# Altium schematic sheet Port.SchDoc
size A4
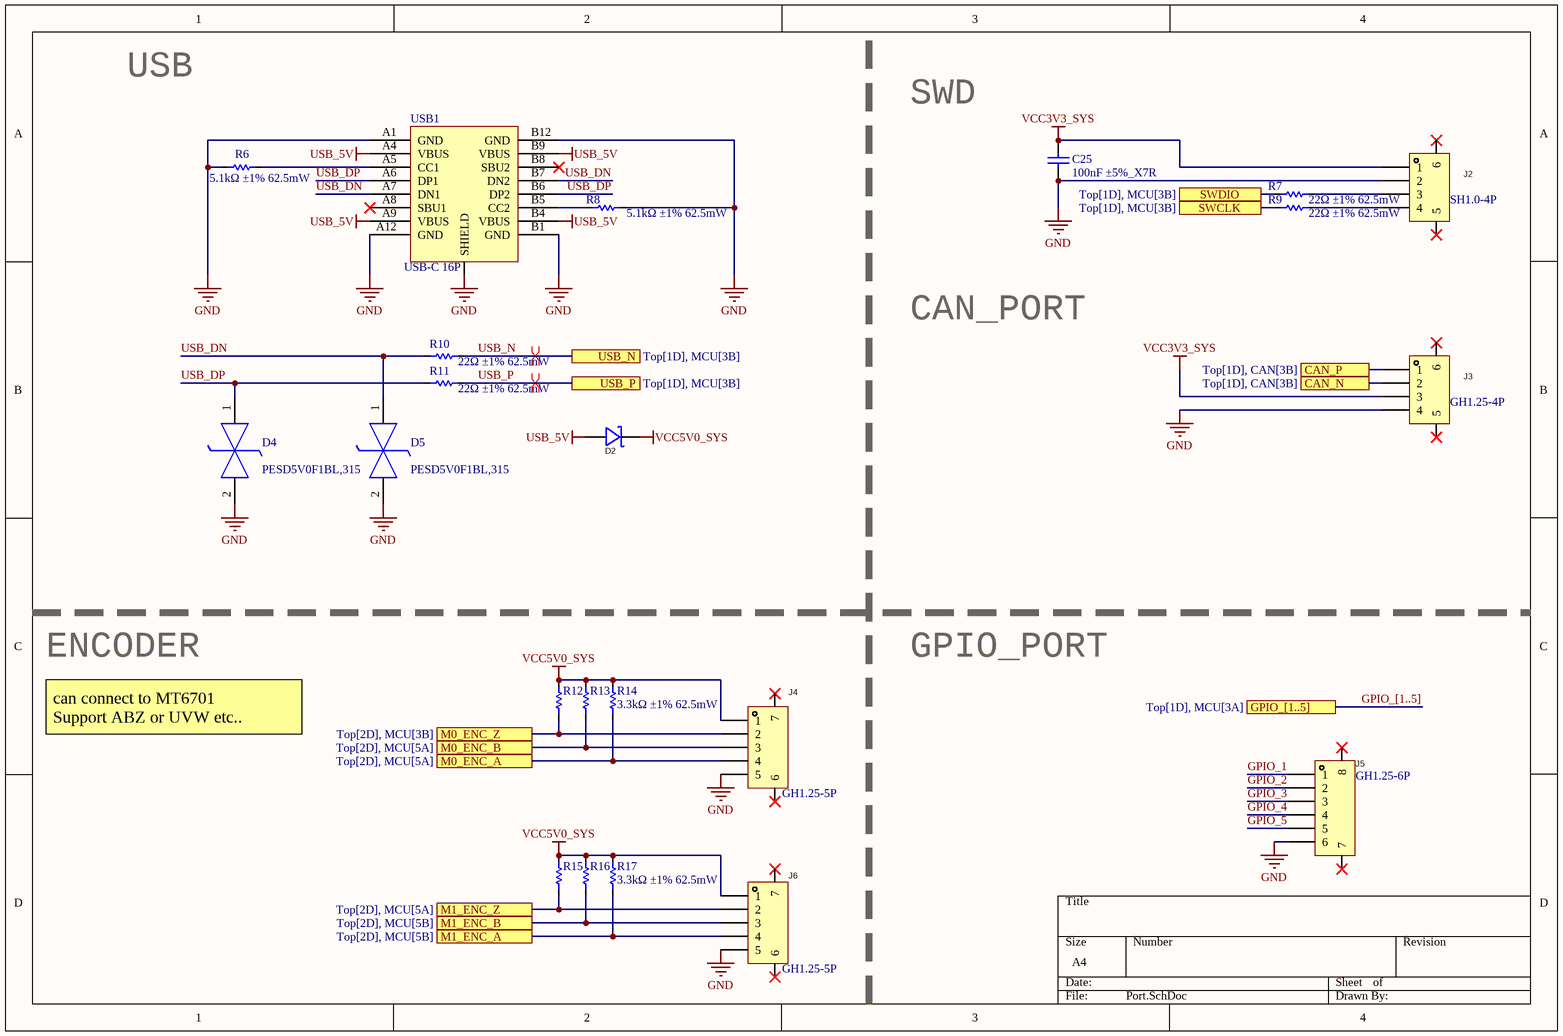
[diagram p0: Port.SchDoc]

## Parts
C25  100nF ±5%_X7R  [C0402]
D2  B340A-13-F  [SMA_L4.4-W2.6-LS5.0-RD]  (value not drawn)
D4  PESD5V0F1BL,315  [PESD5V0S1BL315]
D5  PESD5V0F1BL,315  [PESD5V0S1BL315]
J2  SH1.0-4P  [CONN-SMD_4P-P1.00_BX-SH1.0-4PWT]
J3  GH1.25-4P  [GH1.25-4P]
J4  GH1.25-5P  [GH1.25-5P]
J5  GH1.25-6P  [GH1.25-6P]
J6  GH1.25-5P  [GH1.25-5P]
R6  5.1kΩ ±1% 62.5mW  [R0402]
R7  22Ω ±1% 62.5mW  [R0402]
R8  5.1kΩ ±1% 62.5mW  [R0402]
R9  22Ω ±1% 62.5mW  [R0402]
R10  22Ω ±1% 62.5mW  [R0402]
R11  22Ω ±1% 62.5mW  [R0402]
R12  3.3kΩ ±1% 62.5mW  [R0402]  (value not drawn)
R13  3.3kΩ ±1% 62.5mW  [R0402]  (value not drawn)
R14  3.3kΩ ±1% 62.5mW  [R0402]
R15  3.3kΩ ±1% 62.5mW  [R0402]  (value not drawn)
R16  3.3kΩ ±1% 62.5mW  [R0402]  (value not drawn)
R17  3.3kΩ ±1% 62.5mW  [R0402]
USB1  USB-C 16P  [USB-C-16P]

## Ports
CAN_N (see Top[1D], CAN[3B]), CAN_P (see Top[1D], CAN[3B]), GPIO_[1..5] (see Top[1D], MCU[3A]), M0_ENC_A (see Top[2D], MCU[5A]), M0_ENC_B (see Top[2D], MCU[5A]), M0_ENC_Z (see Top[2D], MCU[3B]), M1_ENC_A (see Top[2D], MCU[5B]), M1_ENC_B (see Top[2D], MCU[5B]), M1_ENC_Z (see Top[2D], MCU[5A]), SWCLK (see Top[1D], MCU[3B]), SWDIO (see Top[1D], MCU[3B]), USB_N (see Top[1D], MCU[3B]), USB_P (see Top[1D], MCU[3B])

## Nets
GND: C25.1 D4.2(K2) D5.2(K2) J2.2 J3.4 J4.5 J5.6 J6.5 R6.1 R8.2 USB1.0(SHIELD) USB1.A1(GND) USB1.A12(GND) USB1.B1(GND) USB1.B12(GND)
USB_5V: D2.2(A) USB1.A4(VBUS) USB1.A9(VBUS) USB1.B4(VBUS) USB1.B9(VBUS)
VCC3V3_SYS: C25.2 J2.1 J3.3
VCC5V0_SYS: D2.1(K) J4.1 J6.1 R12.2 R13.2 R14.2 R15.2 R16.2 R17.2
CAN_N: J3.2 ; port CAN_N
CAN_P: J3.1 ; port CAN_P
GPIO_1: J5.1
GPIO_2: J5.2
GPIO_3: J5.3
GPIO_4: J5.4
GPIO_5: J5.5
M0_ENC_A: J4.4 R14.1 ; port M0_ENC_A
M0_ENC_B: J4.3 R13.1 ; port M0_ENC_B
M0_ENC_Z: J4.2 R12.1 ; port M0_ENC_Z
M1_ENC_A: J6.4 R17.1 ; port M1_ENC_A
M1_ENC_B: J6.3 R16.1 ; port M1_ENC_B
M1_ENC_Z: J6.2 R15.1 ; port M1_ENC_Z
SWCLK: R9.2 ; port SWCLK
SWDIO: R7.1 ; port SWDIO
USB_DN: D5.1(K1) R10.1 USB1.A7(DN1) USB1.B7(DN2)
USB_DP: D4.1(K1) R11.1 USB1.A6(DP1) USB1.B6(DP2)
USB_N: R10.2 ; port USB_N
USB_P: R11.2 ; port USB_P
NetJ2_3: J2.3 R7.2
NetJ2_4: J2.4 R9.1
NetR6_2: R6.2 USB1.A5(CC1)
NetR8_1: R8.1 USB1.B5(CC2)

Not connected (* = marked no-connect by the designer): J2 5* 6*; J3 5* 6*; J4 6* 7*; J5 7* 8*; J6 6* 7*; USB1 A8(SBU1)* B8(SBU2)*

## Buses and harness runs
bus GPIO_[1..5] = port GPIO_[1..5]

## Layout directives
differential pair: USB_N, USB_P

## Notes on the sheet
- USB
- SWD
- CAN_PORT
- ENCODER
- GPIO_PORT
- can connect to MT6701
  Support ABZ or UVW etc..

## Library data of the parts
C25 = Cap: Capacitor; Published: 8-Jun-2000; LatestRevisionDate: 17-Jul-2002; LatestRevisionNote: Re-released for DXP Platform.; PackageReference: RAD-0.3; Publisher: Altium Limited; PackageDescription: Radial Cap, Thru-Hole; 2 Leads; 0.3 in Pin Spacing
D2 = Diode_Schottky: 直流反向耐压(Vr):40V;平均整流电流(Io):3A;正向压降(Vf):500mV@3A;; Manufacturer: DIODES(美台); Add into BOM: yes; Reverse Voltage (Vr): 40V; Average Rectified Current (Io): 3A; Name: B340A-13-F; Symbol: B340A-13-F; Device: B340A-13-F; LCSC Part Name: 40V 3A 500mV@3A; Supplier Part: C85098; Manufacturer Part: B340A-13-F; Supplier Footprint: SMA(DO-214AC); JLCPCB Part Class: 扩展库; Datasheet: https://atta.szlcsc.com/upload/public/pdf/source/20171023/C134454_15087453575121052549.pdf; Supplier: LCSC; Convert to PCB: yes; Forward Voltage (Vf@If): 500mV@3A
D4 D5 = PESD5V0F1BL,315: Diode ESD (Bi-directional); Manufacturer_Name: Nexperia; Datasheet Link: https://assets.nexperia.com/documents/data-sheet/PESD5V0F1BL.pdf; Height: 0mm; Manufacturer_Part_Number: PESD5V0F1BL,315; Mouser Part Number: 771-PESD5V0F1BL315; Mouser Price/Stock: https://www.mouser.co.uk/ProductDetail/Nexperia/PESD5V0F1BL315?qs=GcY6OjH1zdnPNi4NEDIXZQ%3D%3D; Arrow Part Number: PESD5V0F1BL,315; Arrow Price/Stock: https://www.arrow.com/en/products/pesd5v0f1bl315/nexperia?region=nac
J2 = SH1.0-4P: CONN-SMD_4P-P1.25_532610571-2; Manufacturer: BOOMELE(博穆精密); Name: GH1.25-5PLTPZ; Add into BOM: yes; Symbol: GH1.25-5PLTPZ; Device: GH1.25-5PLTPZ; LCSC Part Name: GH1.25-5P立贴编带加盖; Supplier Part: C2829263; Manufacturer Part: GH1.25-5PLTPZ; Supplier Footprint: -; JLCPCB Part Class: Extended Part; Datasheet: https://atta.szlcsc.com/upload/public/pdf/source/20211125/08A09A4909F58AF780B71FE423A00F7E.pdf; Supplier: LCSC; Convert to PCB: yes
J3 = GH1.25-4P: Manufacturer: BOOMELE(博穆精密); Name: GH1.25-5PLTPZ; Add into BOM: yes; Symbol: GH1.25-5PLTPZ; Device: GH1.25-5PLTPZ; LCSC Part Name: GH1.25-5P立贴编带加盖; Supplier Part: C2829263; Manufacturer Part: GH1.25-5PLTPZ; Supplier Footprint: -; JLCPCB Part Class: Extended Part; Datasheet: https://atta.szlcsc.com/upload/public/pdf/source/20211125/08A09A4909F58AF780B71FE423A00F7E.pdf; Supplier: LCSC; Convert to PCB: yes
J4 J6 = GH1.25-5P: Manufacturer: BOOMELE(博穆精密); Name: GH1.25-5PLTPZ; Add into BOM: yes; Symbol: GH1.25-5PLTPZ; Device: GH1.25-5PLTPZ; LCSC Part Name: GH1.25-5P立贴编带加盖; Supplier Part: C2829263; Manufacturer Part: GH1.25-5PLTPZ; Supplier Footprint: -; JLCPCB Part Class: Extended Part; Datasheet: https://atta.szlcsc.com/upload/public/pdf/source/20211125/08A09A4909F58AF780B71FE423A00F7E.pdf; Supplier: LCSC; Convert to PCB: yes
J5 = GH1.25-6P: Manufacturer: BOOMELE(博穆精密); Name: GH1.25-5PLTPZ; Add into BOM: yes; Symbol: GH1.25-5PLTPZ; Device: GH1.25-5PLTPZ; LCSC Part Name: GH1.25-5P立贴编带加盖; Supplier Part: C2829263; Manufacturer Part: GH1.25-5PLTPZ; Supplier Footprint: -; JLCPCB Part Class: Extended Part; Datasheet: https://atta.szlcsc.com/upload/public/pdf/source/20211125/08A09A4909F58AF780B71FE423A00F7E.pdf; Supplier: LCSC; Convert to PCB: yes
R6-R9 = Res: Resistor; Published: 8-Jun-2000; LatestRevisionDate: 17-Jul-2002; LatestRevisionNote: Re-released for DXP Platform.; PackageReference: AXIAL-0.3; Publisher: Altium Limited; PackageDescription: Axial Device, Thru-Hole; 2 Leads; 0.3 in Pin Spacing
R10 R11 = Res: 0402WGF220JTCE; Published: 8-Jun-2000; LatestRevisionDate: 17-Jul-2002; LatestRevisionNote: Re-released for DXP Platform.; PackageReference: AXIAL-0.3; Publisher: Altium Limited; PackageDescription: Axial Device, Thru-Hole; 2 Leads; 0.3 in Pin Spacing
R12-R17 = Res: Published: 8-Jun-2000; LatestRevisionDate: 17-Jul-2002; LatestRevisionNote: Re-released for DXP Platform.; PackageReference: AXIAL-0.3; Publisher: Altium Limited; PackageDescription: Axial Device, Thru-Hole; 2 Leads; 0.3 in Pin Spacing